# EAGLE design proto_board (EAGLE 5.12)
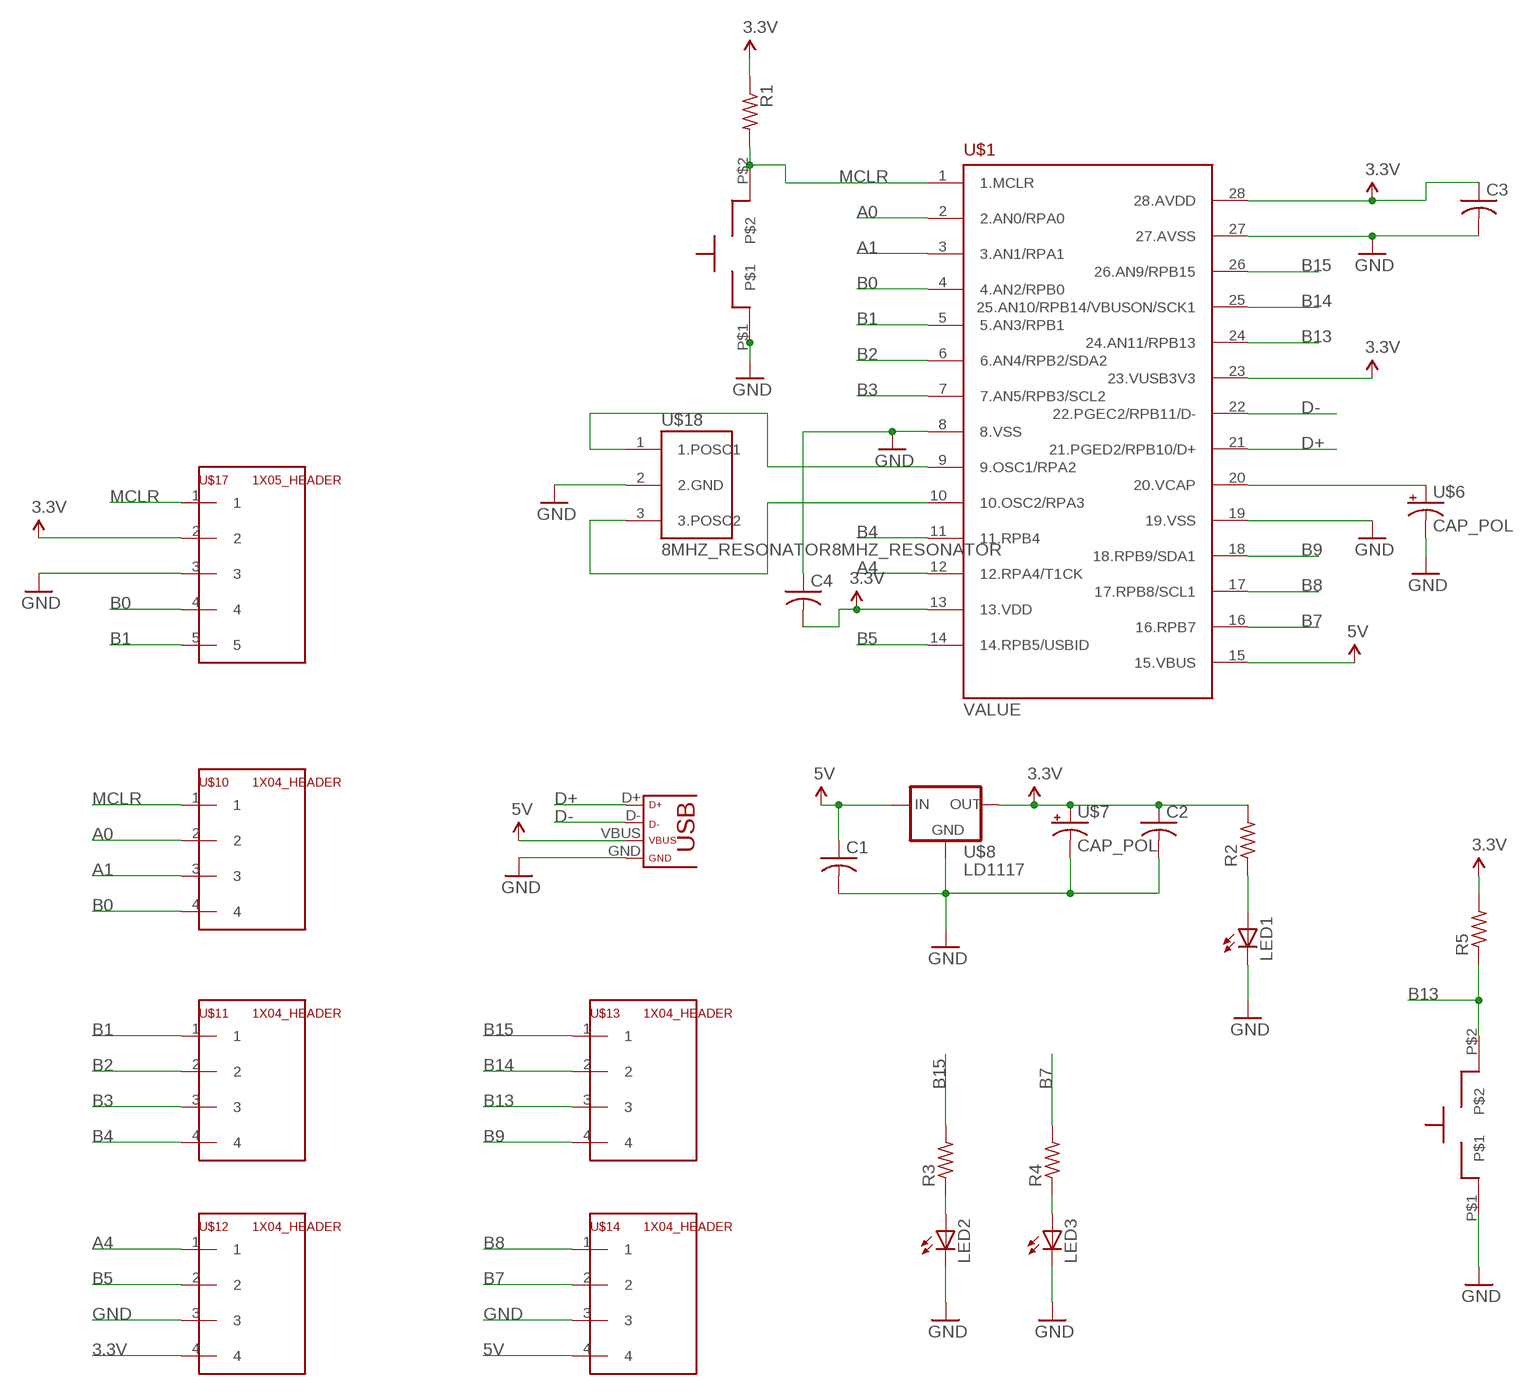
[diagram p0: schematic, sheet 1]

## Parts
C1  C-USC0603  [C0603]
C2  C-USC0603  [C0603]
C3  C-USC0603  [C0603]
C4  C-USC0603  [C0603]
LED1  LED3MM  [LED3MM]
LED2  LED3MM  [LED3MM]
LED3  LED3MM  [LED3MM]
R1  R-US_R0603  [R0603]
R2  R-US_R0603  [R0603]
R3  R-US_R0603  [R0603]
R4  R-US_R0603  [R0603]
R5  R-US_R0603  [R0603]
U$1  PIC32MX250F128BPIC32MX250F128B  [DIL28-6]
U$2  PUSH_BUTTONPUSH_BUTTON  [PUSH_BUTTON]
U$5  USB  [USB-MINIB]
U$6  CAP_POL  [CAP_POL_D]
U$7  CAP_POL  [CAP_POL_D]
U$8  LD1117  [TO220]
U$10  1X04_HEADER  [1X04]
U$11  1X04_HEADER  [1X04]
U$12  1X04_HEADER  [1X04]
U$13  1X04_HEADER  [1X04]
U$14  1X04_HEADER  [1X04]
U$16  PUSH_BUTTONPUSH_BUTTON  [PUSH_BUTTON]
U$17  1X05_HEADER  [1X05]
U$18  8MHZ_RESONATOR8MHZ_RESONATOR  [8MHZ_RESONATOR]

## Nets
3.3V: C2.1 C3.1 C4.2 R1.1 R2.2 R5.2 U$1.13(13.VDD) U$1.23(23.VUSB3V3) U$1.28(28.AVDD) U$7.1(+) U$8.2(OUT) U$12.4 U$17.2
5V: C1.1 U$1.15(15.VBUS) U$5.VBUS U$8.3(IN) U$14.4
A0: U$1.2(2.AN0/RPA0) U$10.2
A1: U$1.3(3.AN1/RPA1) U$10.3
A4: U$1.12(12.RPA4/T1CK) U$12.1
B0: U$1.4(4.AN2/RPB0) U$10.4 U$17.4
B1: U$1.5(5.AN3/RPB1) U$11.1 U$17.5
B2: U$1.6(6.AN4/RPB2/SDA2) U$11.2
B3: U$1.7(7.AN5/RPB3/SCL2) U$11.3
B4: U$1.11(11.RPB4) U$11.4
B5: U$1.14(14.RPB5/USBID) U$12.2
B7: R4.2 U$1.16(16.RPB7) U$14.2
B8: U$1.17(17.RPB8/SCL1) U$14.1
B9: U$1.18(18.RPB9/SDA1) U$13.4
B13: R5.1 U$1.24(24.AN11/RPB13) U$13.3 U$16.P$2
B14: U$1.25(25.AN10/RPB14/VBUSON/SCK1) U$13.2
B15: R3.2 U$1.26(26.AN9/RPB15) U$13.1
D+: U$1.21(21.PGED2/RPB10/D+) U$5.D+
D-: U$1.22(22.PGEC2/RPB11/D-) U$5.D-
GND: C1.2 C2.2 C3.2 C4.1 LED1.K(C) LED2.K(C) LED3.K(C) U$1.8(8.VSS) U$1.19(19.VSS) U$1.27(27.AVSS) U$2.P$1 U$5.GND U$6.2(-) U$7.2(-) U$8.1(GND) U$12.3 U$14.3 U$16.P$1 U$17.3 U$18.2(2.GND)
MCLR: R1.2 U$1.1(1.MCLR) U$2.P$2 U$10.1 U$17.1
N$1: U$1.20(20.VCAP) U$6.1(+)
N$2: U$1.10(10.OSC2/RPA3) U$18.3(3.POSC2)
N$3: U$1.9(9.OSC1/RPA2) U$18.1(1.POSC1)
N$4: LED1.A R2.1
N$5: LED2.A R3.1
N$7: LED3.A R4.1

## Library data of the parts
C1-C4 = resistor:C-US: CAPACITOR, American symbol
LED1-LED3 = led:LED: LED OSRAM: - CHIPLED LG R971, LG N971, LY N971, LG Q971, LY Q971, LO R971, LY R971 LH N974, LH R974 LS Q976, LO Q976, LY Q976 LO Q996 - Hyper CHIPLED LW Q18S LB Q993, LB Q99A, LB R99A - SideLED LS A670, LO A670, LY A670, LG A670, LP A670 LB A673, LV A673, LT A673, LW A673 LH A674 LY A675 LS A676, LA A676, LO A676, LY A676, LW A676 LS A679, LY A679, LG A679 - Hyper Micro SIDELED® LS Y876, LA Y876, LO Y876, LY Y876 LT Y87S - SmartLED LW L88C, LW L88S LB L89C, LB L89S, LG L890 LS L89K, LO L89K, LY L89K LS L896, LA L896, LO L896, LY L896 - TOPLED LS T670, LO T670, LY T670, LG T670, LP T670 LSG T670, LSP T670, LSY T670, LOP T670, LYG T670 LG T671, LOG T671, LSG T671 LB T673, LV T673, LT T673, LW T673 LH T674 LS T676, LA T676, LO T676, LY T676, LB T676, LH T676, LSB T676, LW T676 LB T67C, LV T67C, LT T67C, LS T67K, LO T67K, LY T67K, LW E67C LS E67B, LA E67B, LO E67B, LY E67B, LB E67C, LV E67C, LT E67C LW T67C LS T679, LY T679, LG T679 LS T770, LO T770, LY T770, LG T770, LP T770 LB T773, LV T773, LT T773, LW T773 LH T774 LS E675, LA E675, LY E675, LS T675 LS T776, LA T776, LO T776, LY T776, LB T776 LHGB T686 LT T68C, LB T68C - Hyper Mini TOPLED® LB M676 - Mini TOPLED Santana® LG M470 LS M47K, LO M47K, LY M47K Source: http://www.osram.convergy.de LUXEON: - LUMILED® LXK2-PW12-R00, LXK2-PW12-S00, LXK2-PW14-U00, LXK2-PW14-V00 LXK2-PM12-R00, LXK2-PM12-S00, LXK2-PM14-U00 LXK2-PE12-Q00, LXK2-PE12-R00, LXK2-PE12-S00, LXK2-PE14-T00, LXK2-PE14-U00 LXK2-PB12-K00, LXK2-PB12-L00, LXK2-PB12-M00, LXK2-PB14-N00, LXK2-PB14-P00, LXK2-PB14-Q00 LXK2-PR12-L00, LXK2-PR12-M00, LXK2-PR14-Q00, LXK2-PR14-R00 LXK2-PD12-Q00, LXK2-PD12-R00, LXK2-PD12-S00 LXK2-PH12-R00, LXK2-PH12-S00 LXK2-PL12-P00, LXK2-PL12-Q00, LXK2-PL12-R00 Source: www.luxeon.com KINGBRIGHT: KA-3528ASYC Source: www.kingbright.com
R1-R5 = resistor:R-US_: RESISTOR, American symbol
U$1 = ME433:PIC32MX250F128B
U$2 U$16 = ME433:PUSH_BUTTON
U$5 = ME433:USB
U$6 U$7 = ME433:CAP_POL
U$8 = ME433:LD1117
U$10-U$14 = ME433:1X04_HEADER
U$17 = ME433:1X05_HEADER
U$18 = ME433:8MHZ_RESONATOR

## Board
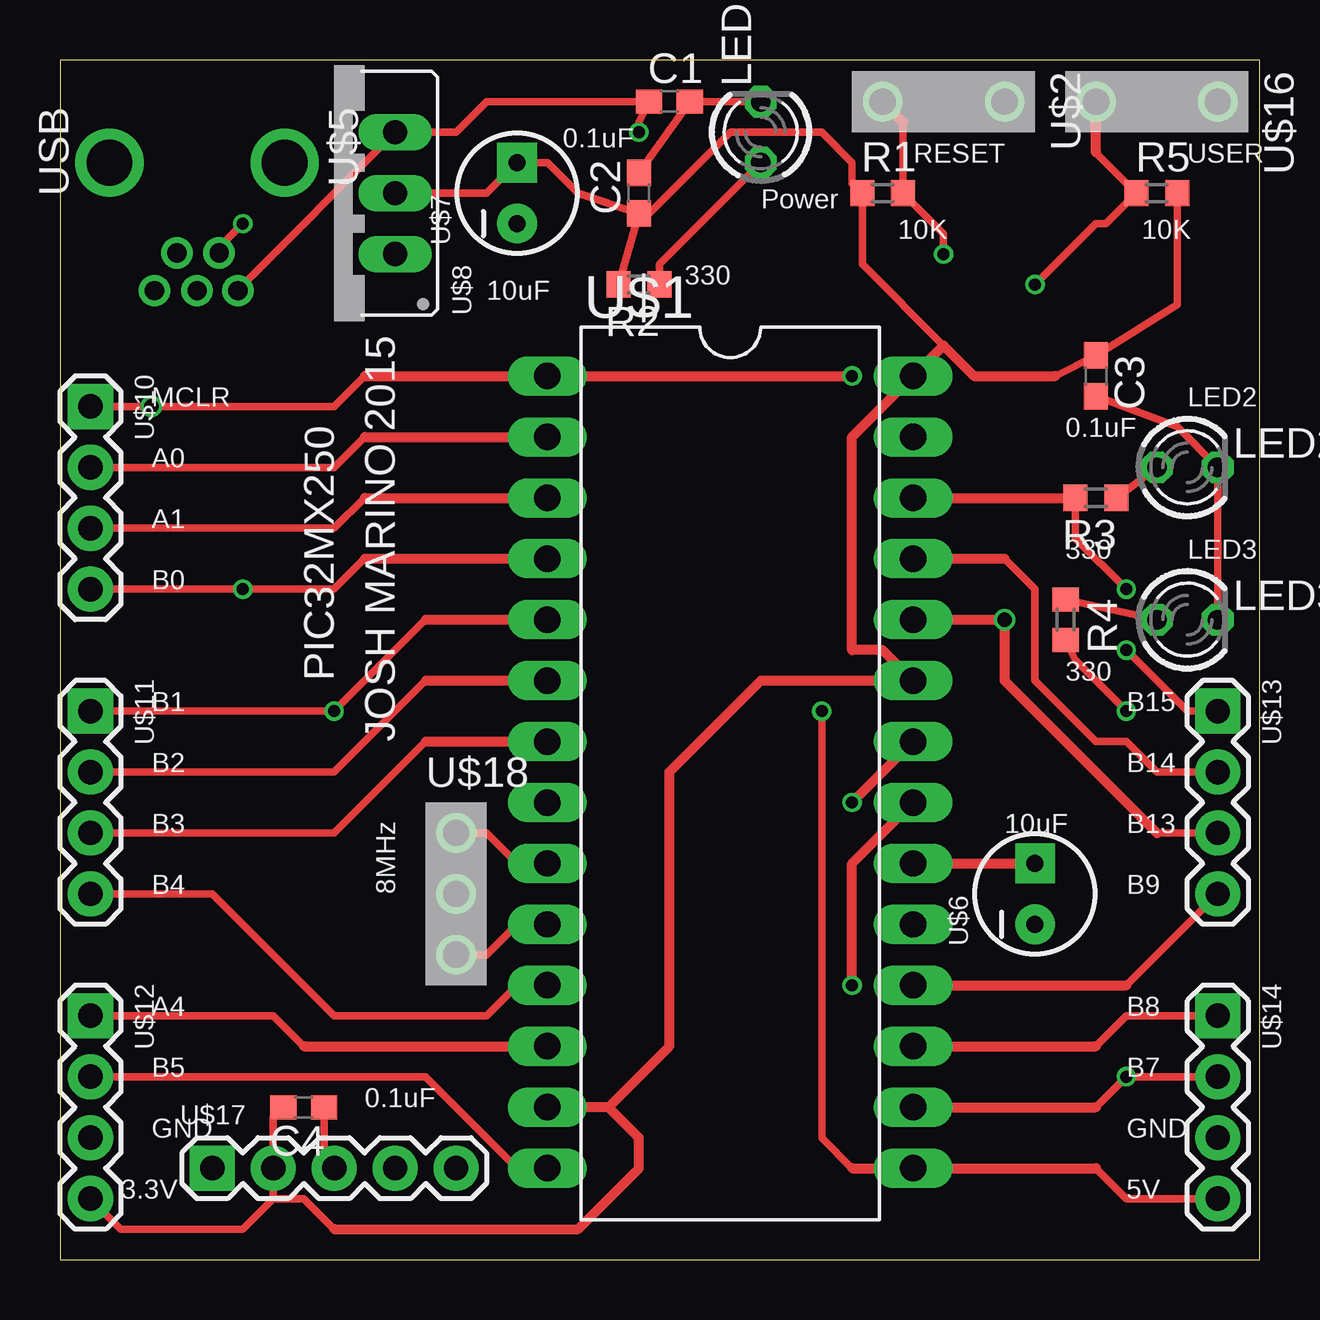
[diagram p1: board, top side]
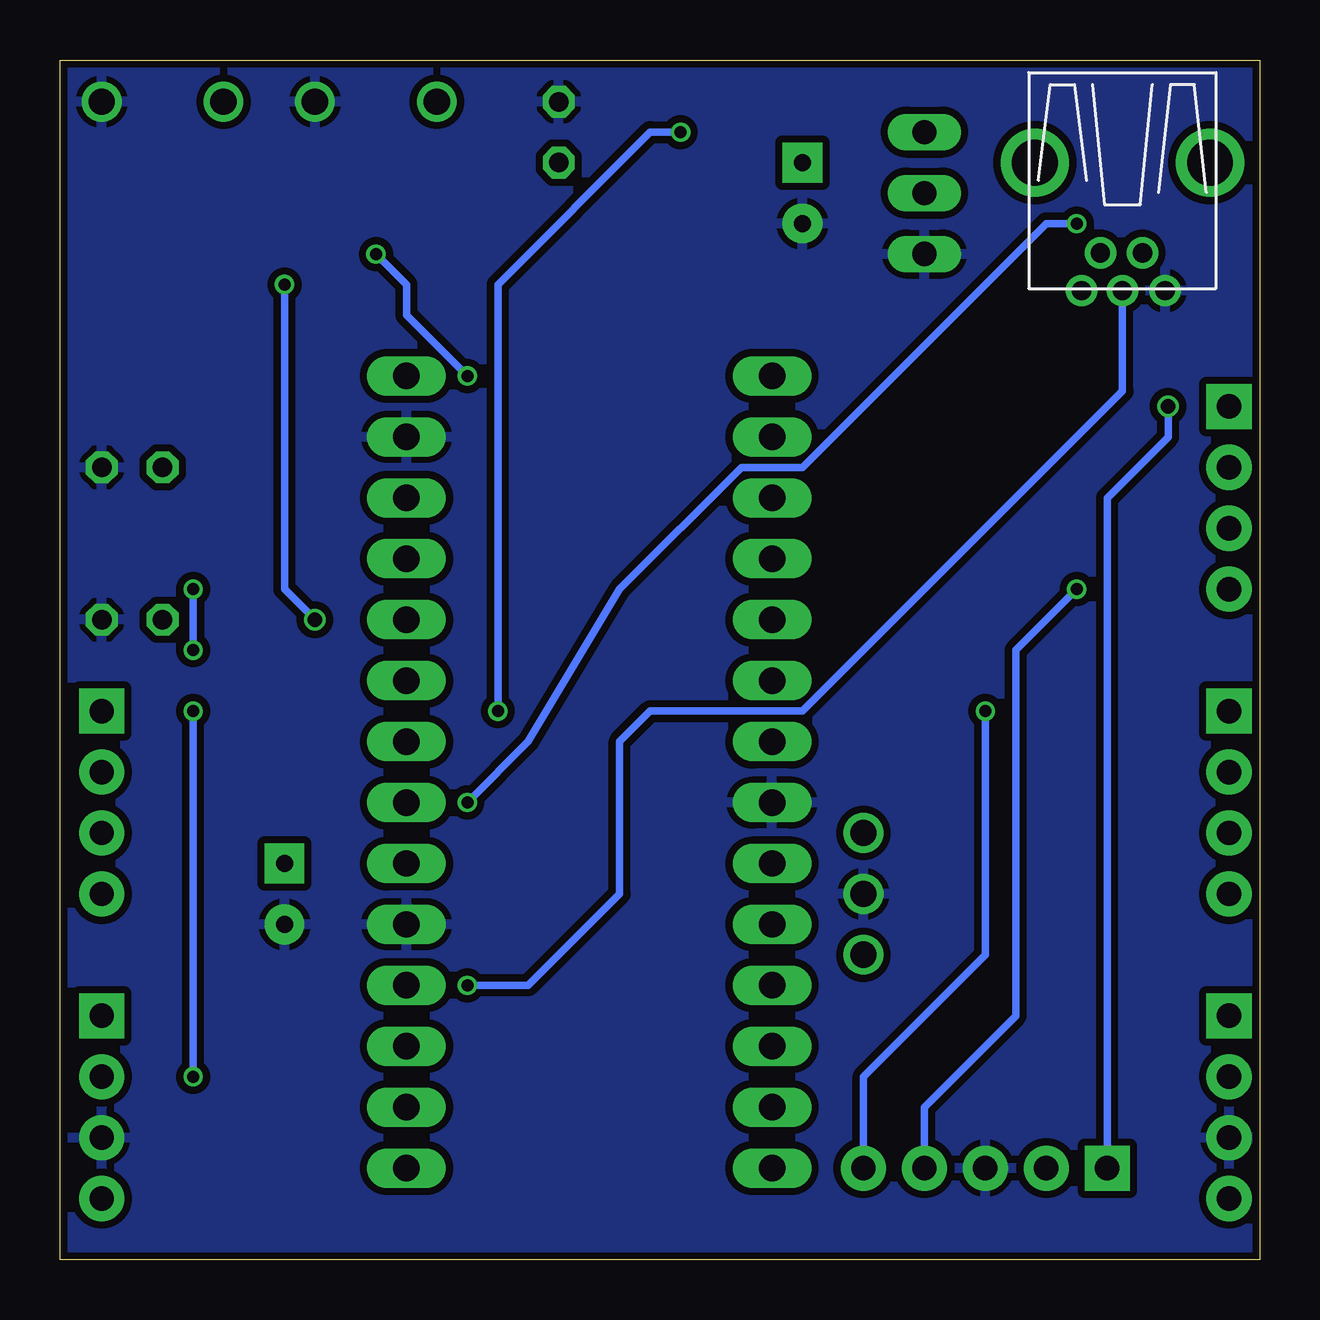
[diagram p2: board, bottom side, seen from below]

Size 50 x 50 mm. Coordinates in mm from the lower left corner, seen from the top.
Outline: 0,0 50,0 50,50 0,50 0,0
Copper layers (1*16): Top 0.035mm / dielectric 1.5mm / Bottom 0.035mm
Design rules "SeeedStudio_2layer_DRU_no_angle_20140221": minimum track width 6mil, minimum drill 12mil, track to track 6mil, track to pad 6mil, pad to pad 6mil, via to via 6mil, smd to smd 0mil, copper to edge 10mil, drill to drill 10mil, minimum pad ring 10mil, minimum via ring 6mil, stop-mask expansion 2mil, vias tented up to drill 100mil, thermal gap 10mil

### Footprints (pad centres in the part's own frame; a part is rotated, then mirrored left to right if it is on the bottom)
C0603 = smd 1.1 x 1: 1 -0.85,0; 2 0.85,0
LED3MM = drill 0.813 octagon: A -1.27,0; K 1.27,0
R0603 = smd 1 x 1.1: 1 -0.85,0; 2 0.85,0
DIL28-6 = drill 1.1 long: 1 -16.51,-7.62; 2 -13.97,-7.62; 3 -11.43,-7.62; 4 -8.89,-7.62; 5 -6.35,-7.62; 6 -3.81,-7.62; 7 -1.27,-7.62; 8 1.27,-7.62; 9 3.81,-7.62; 10 6.35,-7.62; 11 8.89,-7.62; 12 11.43,-7.62; 13 13.97,-7.62; 14 16.51,-7.62; 15 16.51,7.62; 16 13.97,7.62; 17 11.43,7.62; 18 8.89,7.62; 19 6.35,7.62; 20 3.81,7.62; 21 1.27,7.62; 22 -1.27,7.62; 23 -3.81,7.62; 24 -6.35,7.62; 25 -8.89,7.62; 26 -11.43,7.62; 27 -13.97,7.62; 28 -16.51,7.62
PUSH_BUTTON = drill 1.1 round: P$1 0,2.54; P$2 0,-2.54
USB-MINIB = drill 0.8 round: D+ 4.064,0; D- 2.489,0.914; GND 4.064,-1.778; ID 2.489,-0.838; VBUS 4.064,1.702 | drill 1.9 round: P$6 -1.27,-3.65; P$7 -1.27,3.65
CAP_POL_D = drill 0.7 pad 1.651 square: 1 1.27,0 | drill 0.7 pad 1.651 round: 2 -1.27,0
TO220 = drill 1.016 long: 1 -2.54,0; 2 0,0; 3 2.54,0
1X04 = drill 1.016 pad 1.88 square: 1 0,0 | drill 1.016 pad 1.88 round: 2 2.54,0; 3 5.08,0; 4 7.62,0
1X05 = drill 1.016 pad 1.88 square: 1 0,0 | drill 1.016 pad 1.88 round: 2 2.54,0; 3 5.08,0; 4 7.62,0; 5 10.16,0
8MHZ_RESONATOR = drill 1.1 round: 1 0,2.54; 2 0,0; 3 0,-2.54

### Placement (x,y rotation side)
C1  25.4,48.26 0 top
C2  24.13,44.45 90 top
C3  43.18,36.83 270 top
C4  10.16,6.35 180 top
LED1  29.21,46.99 90 top
LED2  46.99,33.02 0 top
LED3  46.99,26.67 0 top
R1  34.29,44.45 0 top
R2  24.13,40.64 180 top
R3  43.18,31.75 180 top
R4  41.91,26.67 270 top
R5  45.72,44.45 0 top
U$1  27.94,20.32 270 top
U$2  36.83,48.26 270 top
U$5  5.71,44.45 270 top
U$6  40.64,15.24 90 top
U$7  19.05,44.45 90 top
U$8  13.97,44.45 90 top
U$10  1.27,35.56 270 top
U$11  1.27,22.86 270 top
U$12  1.27,10.16 270 top
U$13  48.26,22.86 270 top
U$14  48.26,10.16 270 top
U$16  45.72,48.26 270 top
U$17  6.35,3.81 0 top
U$18  16.51,15.24 0 top

### Tracks (layer width: path | path; a pad name or v marks a point on that pad's centre or on a via)
3.3V
  Top 0.305: U$8.2 17.78,44.45 U$7.1 20.32,45.72 21.59,44.45 C2.1 | C2.1 R2.2 | C2.1 24.55,43.6 27.94,46.99 31.75,46.99 33.02,45.72 33.02,44.87 R1.1 33.44,41.49 36.83,38.1 | 41.49,36.83 C3.1 46.57,39.8 R5.2 | U$12.4 2.54,1.27 7.62,1.27 8.89,2.54 | 8.89,2.54 U$17.2 8.89,5.93 C4.2 | 8.89,2.54 10.16,2.54 11.43,1.27
  Top 0.406: 41.49,36.83 38.1,36.83 36.83,38.1 U$1.28 33.02,34.29 33.02,25.4 34.29,25.4 U$1.23 29.21,24.13 25.4,20.32 25.4,8.89 22.86,6.35 | 22.86,6.35 U$1.13 | 11.43,1.27 21.59,1.27 24.13,3.81 24.13,5.08 22.86,6.35
5V  (via drill 0.5)
  Top 0.305: 43.18,3.81 44.45,2.54 U$14.4 | U$5.VBUS 7.42,40.44 U$8.3 16.51,46.99 17.78,48.26 C1.1 24.13,47.41 v24.13,46.99 | 33.02,3.81 31.75,5.08 v31.75,22.86
  Top 0.406: 33.02,3.81 U$1.15 43.18,3.81
  Bottom 0.305: v31.75,22.86 31.75,40.64 25.4,46.99 v24.13,46.99
A0
  Top 0.305: U$10.2 11.43,33.02 12.7,34.29
  Top 0.406: 12.7,34.29 U$1.2
A1
  Top 0.305: U$10.3 11.43,30.48 12.7,31.75
  Top 0.406: 12.7,31.75 U$1.3
A4
  Top 0.305: U$12.1 8.89,10.16 10.16,8.89
  Top 0.406: 10.16,8.89 U$1.12
B0  (via drill 0.5)
  Top 0.305: U$10.4 v7.62,27.94 11.43,27.94 12.7,29.21
  Top 0.406: 12.7,29.21 U$1.4
  Bottom 0.305: U$17.4 13.97,6.35 10.16,10.16 10.16,25.4 v7.62,27.94
B1  (via drill 0.5)
  Top 0.305: U$11.1 v11.43,22.86 15.24,26.67
  Top 0.406: 15.24,26.67 U$1.5
  Bottom 0.305: U$17.5 16.51,7.62 11.43,12.7 v11.43,22.86
B2
  Top 0.305: U$11.2 11.43,20.32 15.24,24.13
  Top 0.406: 15.24,24.13 U$1.6
B3
  Top 0.305: U$11.3 11.43,17.78 15.24,21.59
  Top 0.406: 15.24,21.59 U$1.7
B4
  Top 0.305: U$11.4 6.35,15.24 11.43,10.16 17.78,10.16 19.05,11.43
  Top 0.406: 19.05,11.43 U$1.11
B5
  Top 0.305: U$12.2 15.24,7.62 19.05,3.81
  Top 0.406: 19.05,3.81 U$1.14
B7  (via drill 0.5)
  Top 0.305: 43.18,6.35 v44.45,7.62 U$14.2 | R4.2 42.33,24.98 v44.45,22.86
  Top 0.406: U$1.16 43.18,6.35
  Bottom 0.305: v44.45,7.62 v44.45,22.86
B8
  Top 0.305: 43.18,8.89 44.45,10.16 U$14.1
  Top 0.406: U$1.17 43.18,8.89
B9
  Top 0.305: 44.45,11.43 U$13.4
  Top 0.406: U$1.18 44.45,11.43
B13  (via drill 0.5, 0.6)
  Top 0.305: 43.18,46.14 R5.1 43.6,43.18 43.18,43.18 v40.64,40.64 | 45.72,17.78 U$13.3
  Top 0.406: U$1.24 v39.37,26.67 39.37,24.13 45.72,17.78 | 43.18,46.14 U$16.P$2
  Bottom 0.305: v39.37,26.67 40.64,27.94 v40.64,40.64
B14
  Top 0.305: U$13.2 45.72,20.32 44.45,21.59 43.18,21.59 40.64,24.13 40.64,27.94 39.37,29.21
  Top 0.406: U$1.25 39.37,29.21
B15  (via drill 0.5)
  Top 0.305: R3.2 42.33,30.06 v44.45,27.94 | v44.45,25.4 46.99,22.86 U$13.1
  Top 0.406: U$1.26 R3.2
  Bottom 0.305: v44.45,27.94 v44.45,25.4
D+  (via drill 0.5)
  Top 0.406: U$1.21 33.02,16.51 v33.02,11.43
  Bottom 0.305: v33.02,11.43 30.48,11.43 26.67,15.24 26.67,21.59 25.4,22.86 19.05,22.86 5.71,36.2 U$5.D+
D-  (via drill 0.5)
  Top 0.305: U$5.D- 6.63,42.19 v7.62,43.18
  Top 0.406: v33.02,19.05 U$1.22
  Bottom 0.305: v7.62,43.18 8.89,43.18 19.05,33.02 21.59,33.02 26.67,27.94 30.48,21.59 v33.02,19.05
GND
  Top 0.305: LED1.K C1.2 C2.2 | C3.2 46.57,34.71 LED2.K LED3.K | C4.1 11.01,4.23 U$17.3
  pour Bottom (isolate 0.305): -1.27,50.8 -1.27,-1.27 50.8,-1.27 50.8,50.8
MCLR  (via drill 0.5, 0.6)
  Top 0.305: U$10.1 v3.81,35.56 11.43,35.56 12.7,36.83 | 35.14,47.41 R1.2 36.83,42.76 v36.83,41.91
  Top 0.406: 12.7,36.83 U$1.1 v33.02,36.83 | 35.14,47.41 U$2.P$2
  Bottom 0.305: v3.81,35.56 3.81,34.29 6.35,31.75 U$17.1 | v33.02,36.83 35.56,39.37 35.56,40.64 v36.83,41.91
N$1
  Top 0.406: U$1.20 U$6.1
N$2
  Top 0.305: 19.05,13.97 17.78,12.7 U$18.3
  Top 0.406: 19.05,13.97 U$1.10
N$3
  Top 0.305: 19.05,16.51 17.78,17.78 U$18.1
  Top 0.406: 19.05,16.51 U$1.9
N$4
  Top 0.305: R2.1 24.98,41.49 LED1.A
N$5
  Top 0.305: R3.1 LED2.A
N$7
  Top 0.305: R4.1 LED3.A

### Text on the board
tPlace: 0.1uF | RESET | USER | Power | 10K | 10K | 330 | 10uF | MCLR | LED2 | 0.1uF | A0 | A1 | 330 | LED3 | B0 | PIC32MX250 | 330 | B1 | B15 | JOSH MARINO 2015 | B2 | B14 | B3 | 10uF | B13 | B4 | 8MHz | B9 | A4 | B8 | B5 | B7 | 0.1uF | GND | GND | 3.3V | 5V